# EAGLE design divchrono-encoder (EAGLE 7.5.0)
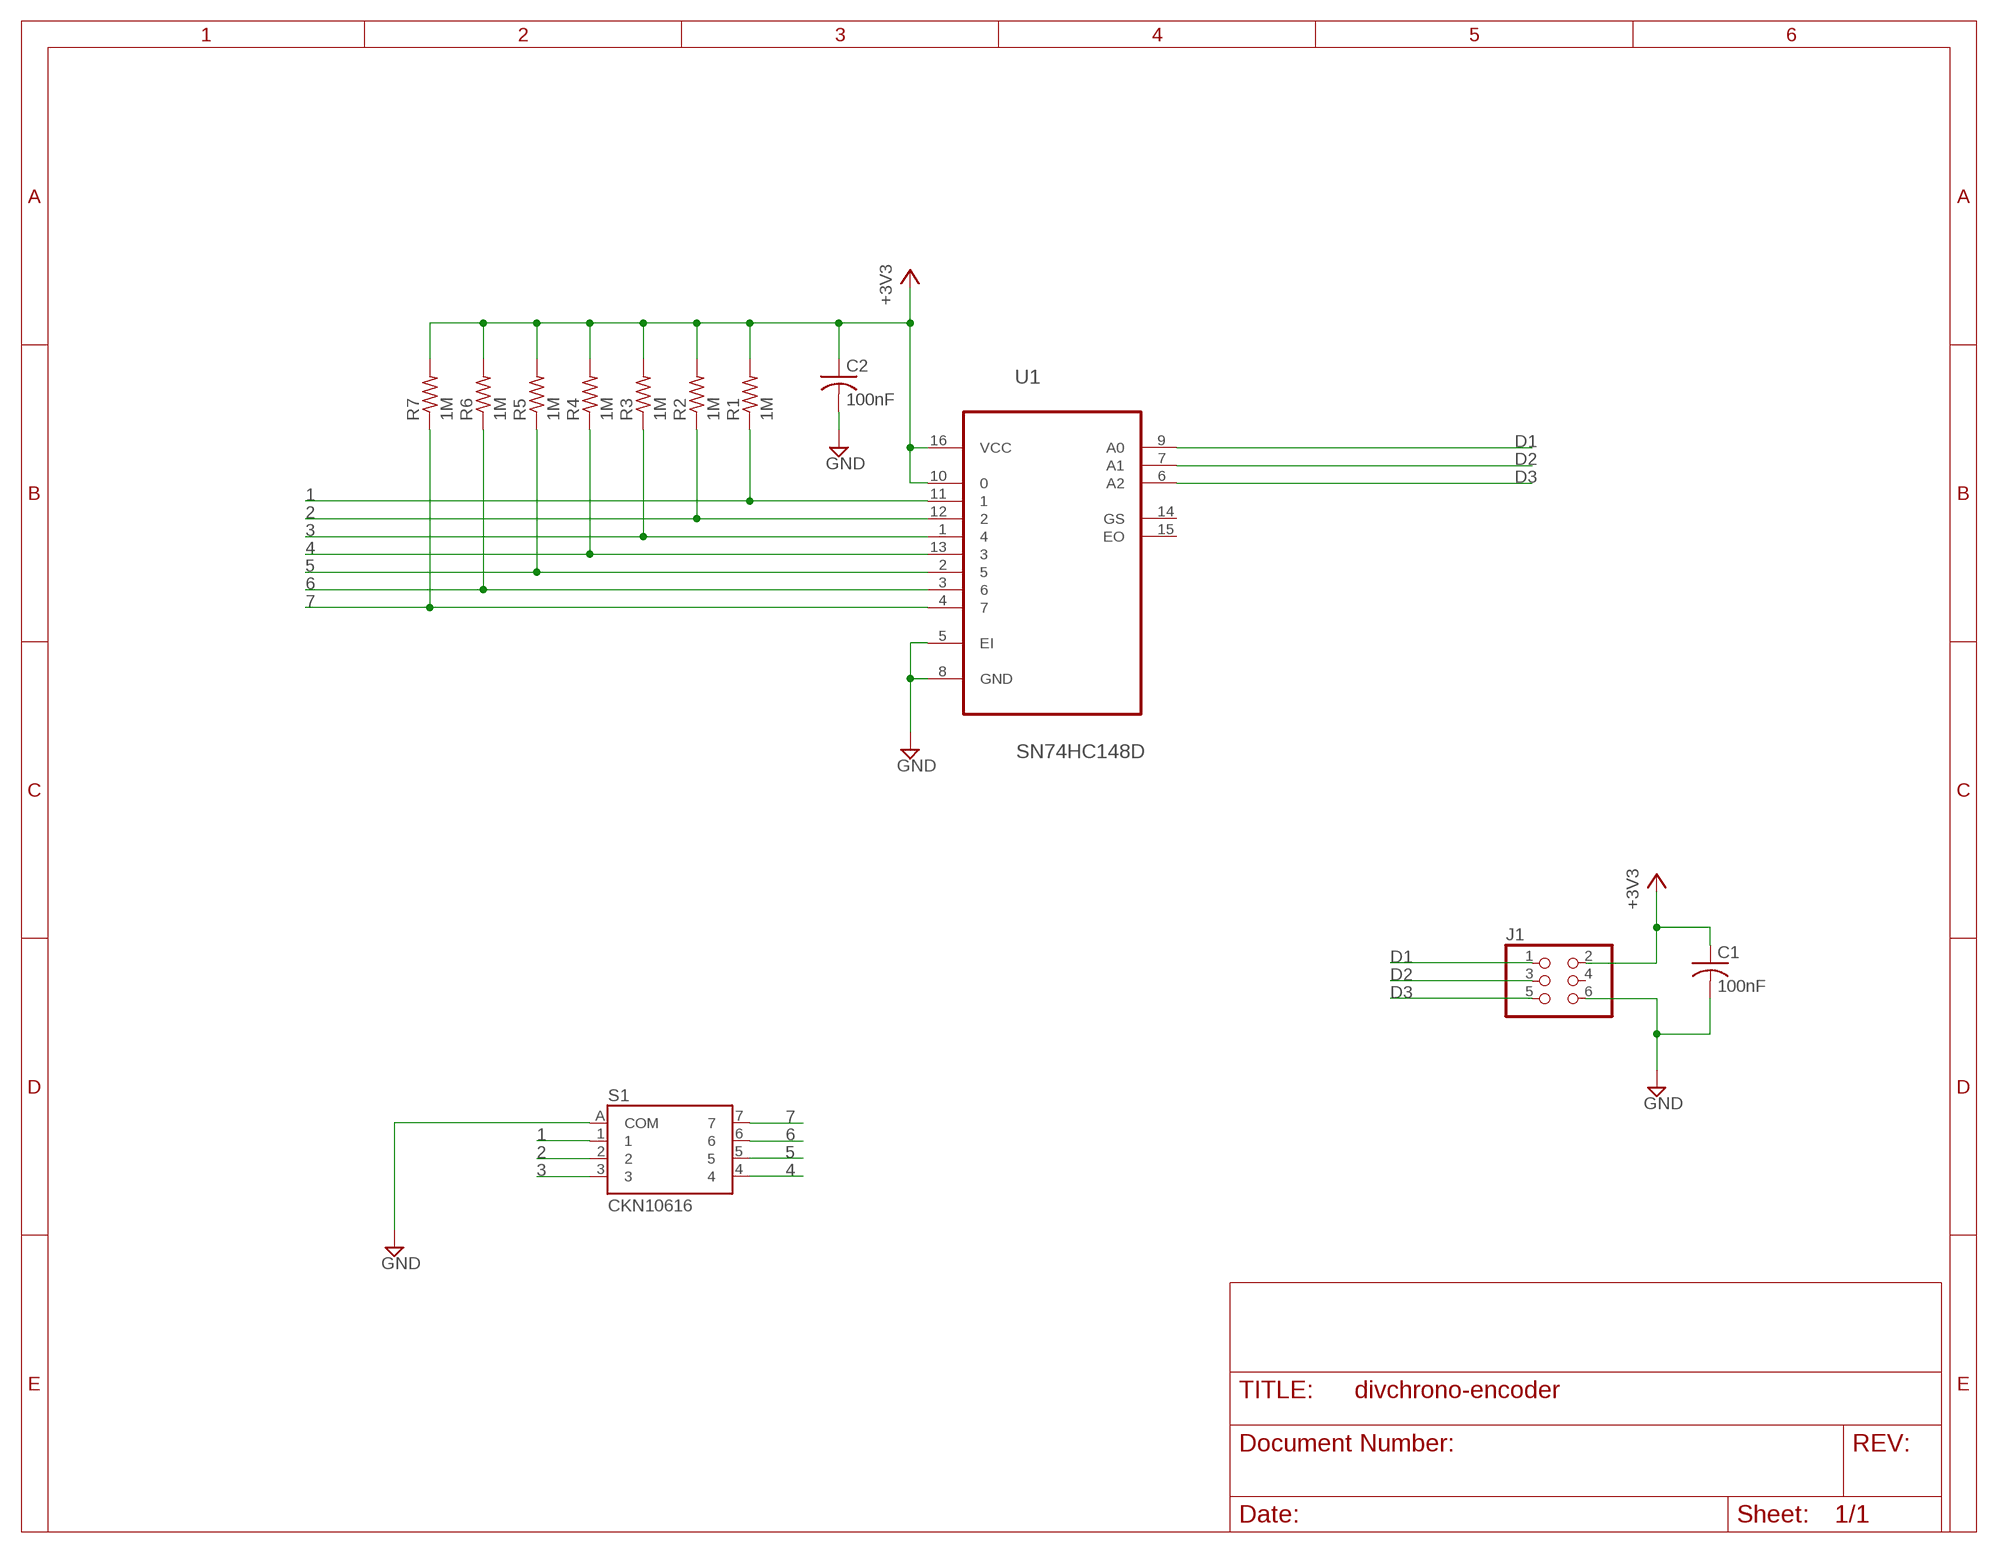
[diagram p0: schematic, sheet 1]

## Parts
C1  100nF  C-USC1206  [C1206]
C2  100nF  C-USC1206  [C1206]
J1  PINHD-2X3  [2X03]
R1  1M  R-US_R1206  [R1206]
R2  1M  R-US_R1206  [R1206]
R3  1M  R-US_R1206  [R1206]
R4  1M  R-US_R1206  [R1206]
R5  1M  R-US_R1206  [R1206]
R6  1M  R-US_R1206  [R1206]
R7  1M  R-US_R1206  [R1206]
S1  CKN10616  [CKN10616]
U1  SN74HC148D  [SOIC127P600X175-16N]

## Nets
1: R1.1 S1.1 U1.11
2: R2.1 S1.2 U1.12
3: R3.1 S1.3 U1.1
4: R4.1 S1.4 U1.13
5: R5.1 S1.5 U1.2
6: R6.1 S1.6 U1.3
7: R7.1 S1.7 U1.4
+3V3: C1.1 C2.1 J1.2 R1.2 R2.2 R3.2 R4.2 R5.2 R6.2 R7.2 U1.10 U1.16(VCC)
D1: J1.1 U1.9(A0)
D2: J1.3 U1.7(A1)
D3: J1.5 U1.6(A2)
GND: C1.2 C2.2 J1.6 S1.A(COM) U1.5(EI) U1.8(GND)
Unconnected: J1.4 U1.14(GS) U1.15(EO)

## Library data of the parts
C1 C2 = rcl:C-US: CAPACITOR, American symbol
J1 = pinhead:PINHD-2X3: PIN HEADER
R1-R7 = rcl:R-US_: RESISTOR, American symbol
S1 = divchrono:CKN10616
U1 = Texas Instruments_By_element14_Batch_1:SN74HC148D: 8:3 line Priority Encoder; MPN: SN74HC148D; OC_FARNELL: 1287478; OC_NEWARK: 35K0804; PACKAGE: SOIC-16; SUPPLIER: Texas Instruments

## Board
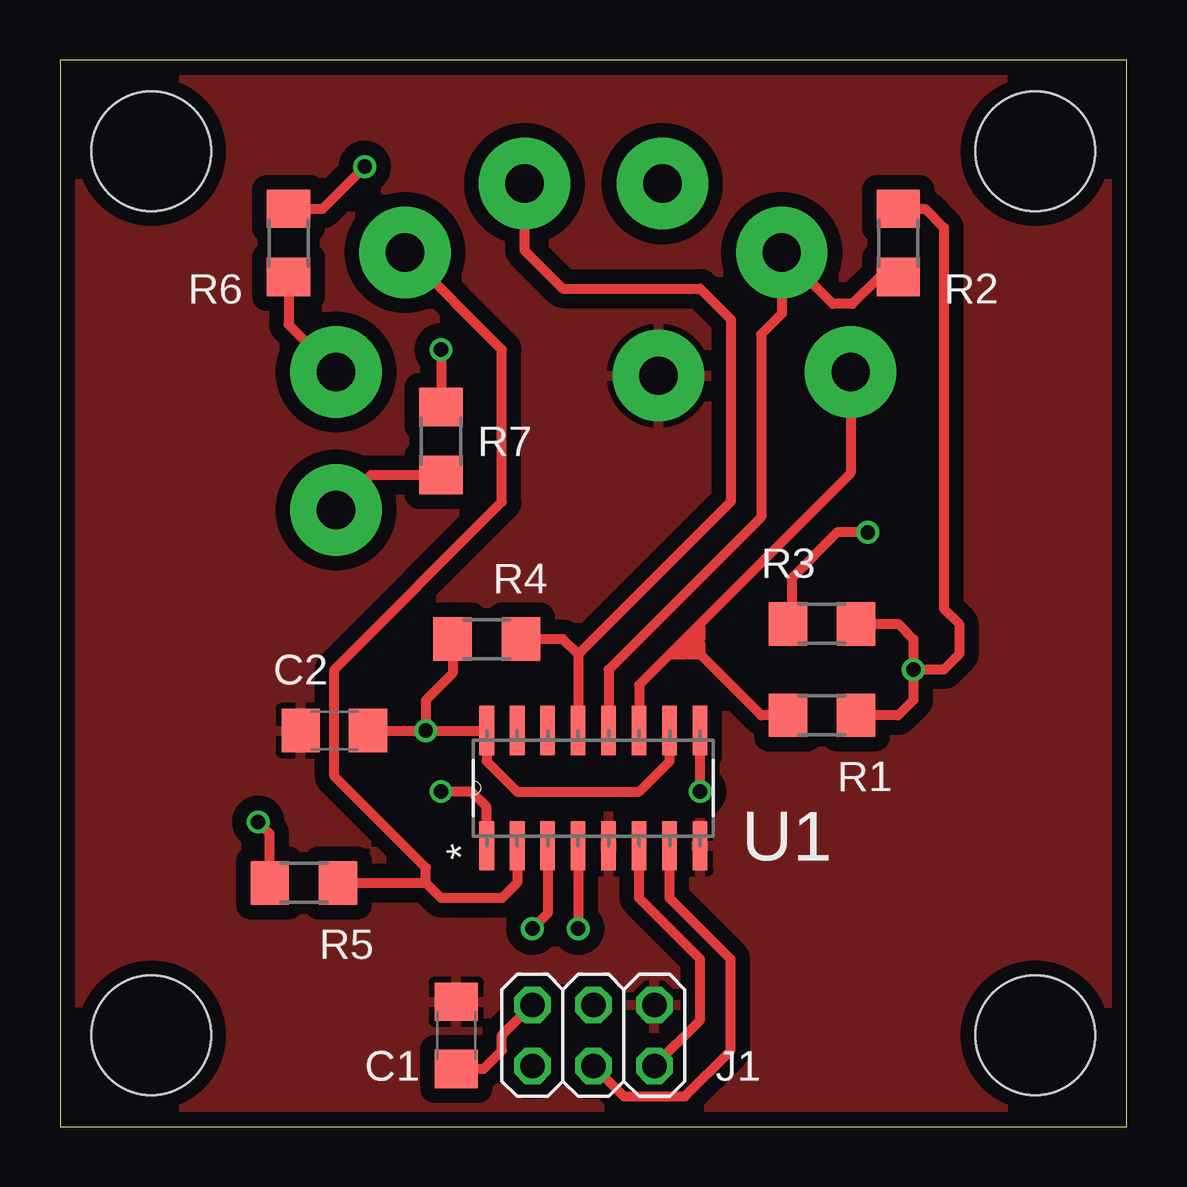
[diagram p1: board, top side]
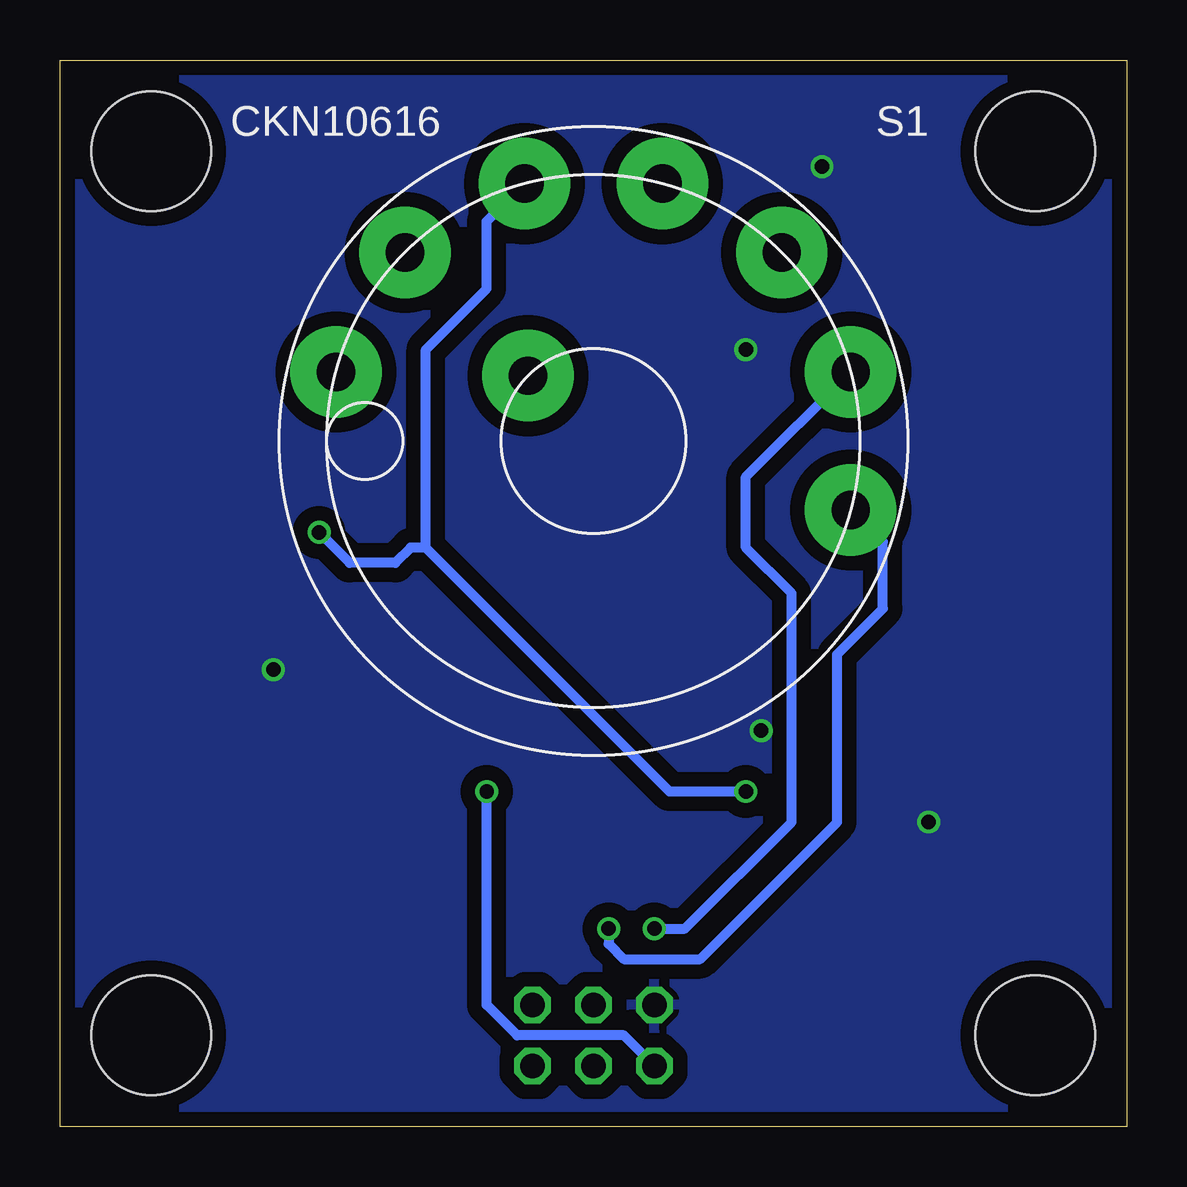
[diagram p2: board, bottom side, seen from below]

Size 44.45 x 44.45 mm. Coordinates in mm from the lower left corner, seen from the top.
Outline: 0,0 44.45,0 44.45,44.45 0,44.45 0,0
Copper layers (1*16): Top 0.0356mm / dielectric 1.5011mm / Bottom 0.0356mm
Design rules "LaenPCBOrder": minimum track width 6mil, minimum drill 13mil, track to track 6mil, track to pad 6mil, pad to pad 6mil, via to via 6mil, smd to smd 6mil, copper to edge 15mil, drill to drill 6mil, minimum pad ring 7mil, minimum via ring 7mil, stop-mask expansion 3mil, vias tented up to drill 0mil, thermal gap 10mil
Holes 4.98 mm at 3.81,40.64 40.64,40.64 40.64,3.81 3.81,3.81

### Footprints (pad centres in the part's own frame; a part is rotated, then mirrored left to right if it is on the bottom)
C1206 = smd 1.6 x 1.8: 1 -1.4,0; 2 1.4,0
2X03 = drill 1.016 octagon: 1 -2.54,-1.27; 2 -2.54,1.27; 3 0,-1.27; 4 0,1.27; 5 2.54,-1.27; 6 2.54,1.27
R1206 = smd 1.6 x 1.803: 1 -1.422,0; 2 1.422,0
CKN10616 = drill 1.6 pad 3.81: 1 10.721,-2.873; 2 7.849,-7.849; 3 2.873,-10.721; 4 -2.873,-10.721; 5 -7.849,-7.849; 6 -10.721,-2.873; 7 -10.721,2.873; A 2.72,-2.72
SOIC127P600X175-16N = smd 2.057 x 0.61: 1 -4.801,8.89; 2 -4.801,7.62; 3 -4.801,6.35; 4 -4.801,5.08; 5 -4.801,3.81; 6 -4.801,2.54; 7 -4.801,1.27; 8 -4.801,0; 9 0,0; 10 0,1.27; 11 0,2.54; 12 0,3.81; 13 0,5.08; 14 0,6.35; 15 0,7.62; 16 0,8.89

### Placement (x,y rotation side)
C1  16.51,3.81 90 top
C2  11.43,16.51 180 top
J1  22.23,3.81 0 top
R1  31.75,17.14 0 top
R2  34.92,36.83 90 top
R3  31.75,20.95 0 top
R4  17.78,20.32 180 top
R5  10.16,10.16 180 top
R6  9.53,36.83 90 top
R7  15.88,28.57 90 top
S1  22.23,28.57 180 bottom
U1  26.67,16.51 90 top

### Tracks (layer width: path | path; a pad name or v marks a point on that pad's centre or on a via)
1
  Top 0.406: S1.1 32.95,27.23 26.6,20.89 | 26.6,20.89 26.27,20.56 | 26.27,20.56 26.04,20.32 | 26.04,20.32 25.81,20.1 | 25.81,20.1 25.4,19.68 | U1.11 24.13,18.41 25.31,19.59 25.4,19.68 | R1.1 29.21,17.14 26.67,19.68 | 26.67,19.68 26.04,20.32 | 26.27,20.56 26.67,20.16 26.67,19.68 | 25.81,20.1 26.23,19.68 26.67,19.68 | 26.6,20.89 26.67,20.82 26.67,20.32 | 25.4,19.68 26.04,19.68
2
  Top 0.406: U1.12 22.86,19.05 29.21,25.4 29.21,33.02 30.07,33.88 S1.2 32.21,34.29 33.02,34.29 34.14,35.41 R2.1
3  (via drill 0.6)
  Top 0.406: U1.1 17.78,13.34 17.14,13.97 v15.88,13.97 | v33.66,24.77 32.38,24.77 30.48,22.86 30.48,21.11 R3.1
  Bottom 0.406: v15.88,13.97 19.05,13.97 29.21,24.13 | 29.21,24.13 29.21,32.38 26.67,34.92 26.67,37.72 S1.3 | 29.21,24.13 29.84,24.13 30.48,23.5 32.38,23.5 v33.66,24.77
4
  Top 0.406: S1.4 19.35,36.53 20.95,34.92 26.67,34.92 27.94,33.66 27.94,26.04 21.59,19.68 | 21.59,19.68 U1.13 | 21.59,19.68 20.95,20.32 R4.1
5
  Top 0.406: U1.2 19.05,10.16 18.41,9.53 15.88,9.53 15.24,10.16 | 15.24,10.16 15.24,10.79 11.43,14.61 11.43,19.05 18.41,26.04 18.41,32.38 S1.5 | R5.1 15.24,10.16
6  (via drill 0.6)
  Top 0.406: U1.3 20.32,8.89 v19.68,8.26 | R6.1 9.53,33.43 S1.6
  Bottom 0.406: v19.68,8.26 18.41,8.26 13.97,12.7 13.97,22.23 15.88,24.13 15.88,27.08 S1.6
7  (via drill 0.6)
  Top 0.406: U1.4 v21.59,8.26 | R7.1 12.95,27.15 S1.7
  Bottom 0.406: v21.59,8.26 21.59,7.62 20.95,6.99 17.78,6.99 12.06,12.7 12.06,19.68 10.16,21.59 10.16,24.36 S1.7
+3V3  (via drill 0.6)
  Top 0.406: C2.1 v15.24,16.51 | v15.24,16.51 U1.16 17.78,15.24 19.05,13.97 24.13,13.97 25.4,15.24 U1.10 | C1.1 17.65,2.41 18.41,3.17 18.41,3.81 J1.2 | R6.2 10.95,38.25 v12.7,40.01 | v15.88,32.38 R7.2 | R3.2 34.92,20.95 35.56,20.32 v35.56,19.05 | v35.56,19.05 35.56,17.78 34.92,17.14 R1.2 | R2.2 36.04,38.25 36.83,37.47 36.83,21.59 37.47,20.95 37.47,19.68 36.83,19.05 v35.56,19.05 | R4.2 16.36,18.9 15.24,17.78 v15.24,16.51 | R5.2 8.74,12.22 v8.26,12.7
  pour Bottom (isolate 0.61): 0,44.45 44.45,44.45 44.45,0 0,0
D1  (via drill 0.6)
  Top 0.406: v26.67,13.97 U1.9
  Bottom 0.406: J1.1 20.95,3.81 25.4,3.81 26.67,5.08 v26.67,13.97
D2
  Top 0.406: J1.3 23.5,1.27 26.04,1.27 27.94,3.17 27.94,6.99 25.4,9.53 U1.7
D3
  Top 0.406: J1.5 26.67,4.45 26.67,6.99 24.13,9.53 U1.6
GND
  pour Top (isolate 0.61): 0,0 0,44.45 44.45,44.45 44.45,0